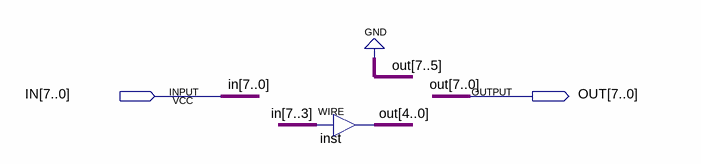
[diagram p0: schematic sheet]
// Quartus schematic SR3.bdf as structural Verilog: 1 symbols, 2 pins
module SR3 (
  input  [7:0] IN,
  output [7:0] OUT
);

  assign OUT[4:0] = IN[7:3];  // WIRE inst

  assign OUT[7:5] = 3'b000;
endmodule
